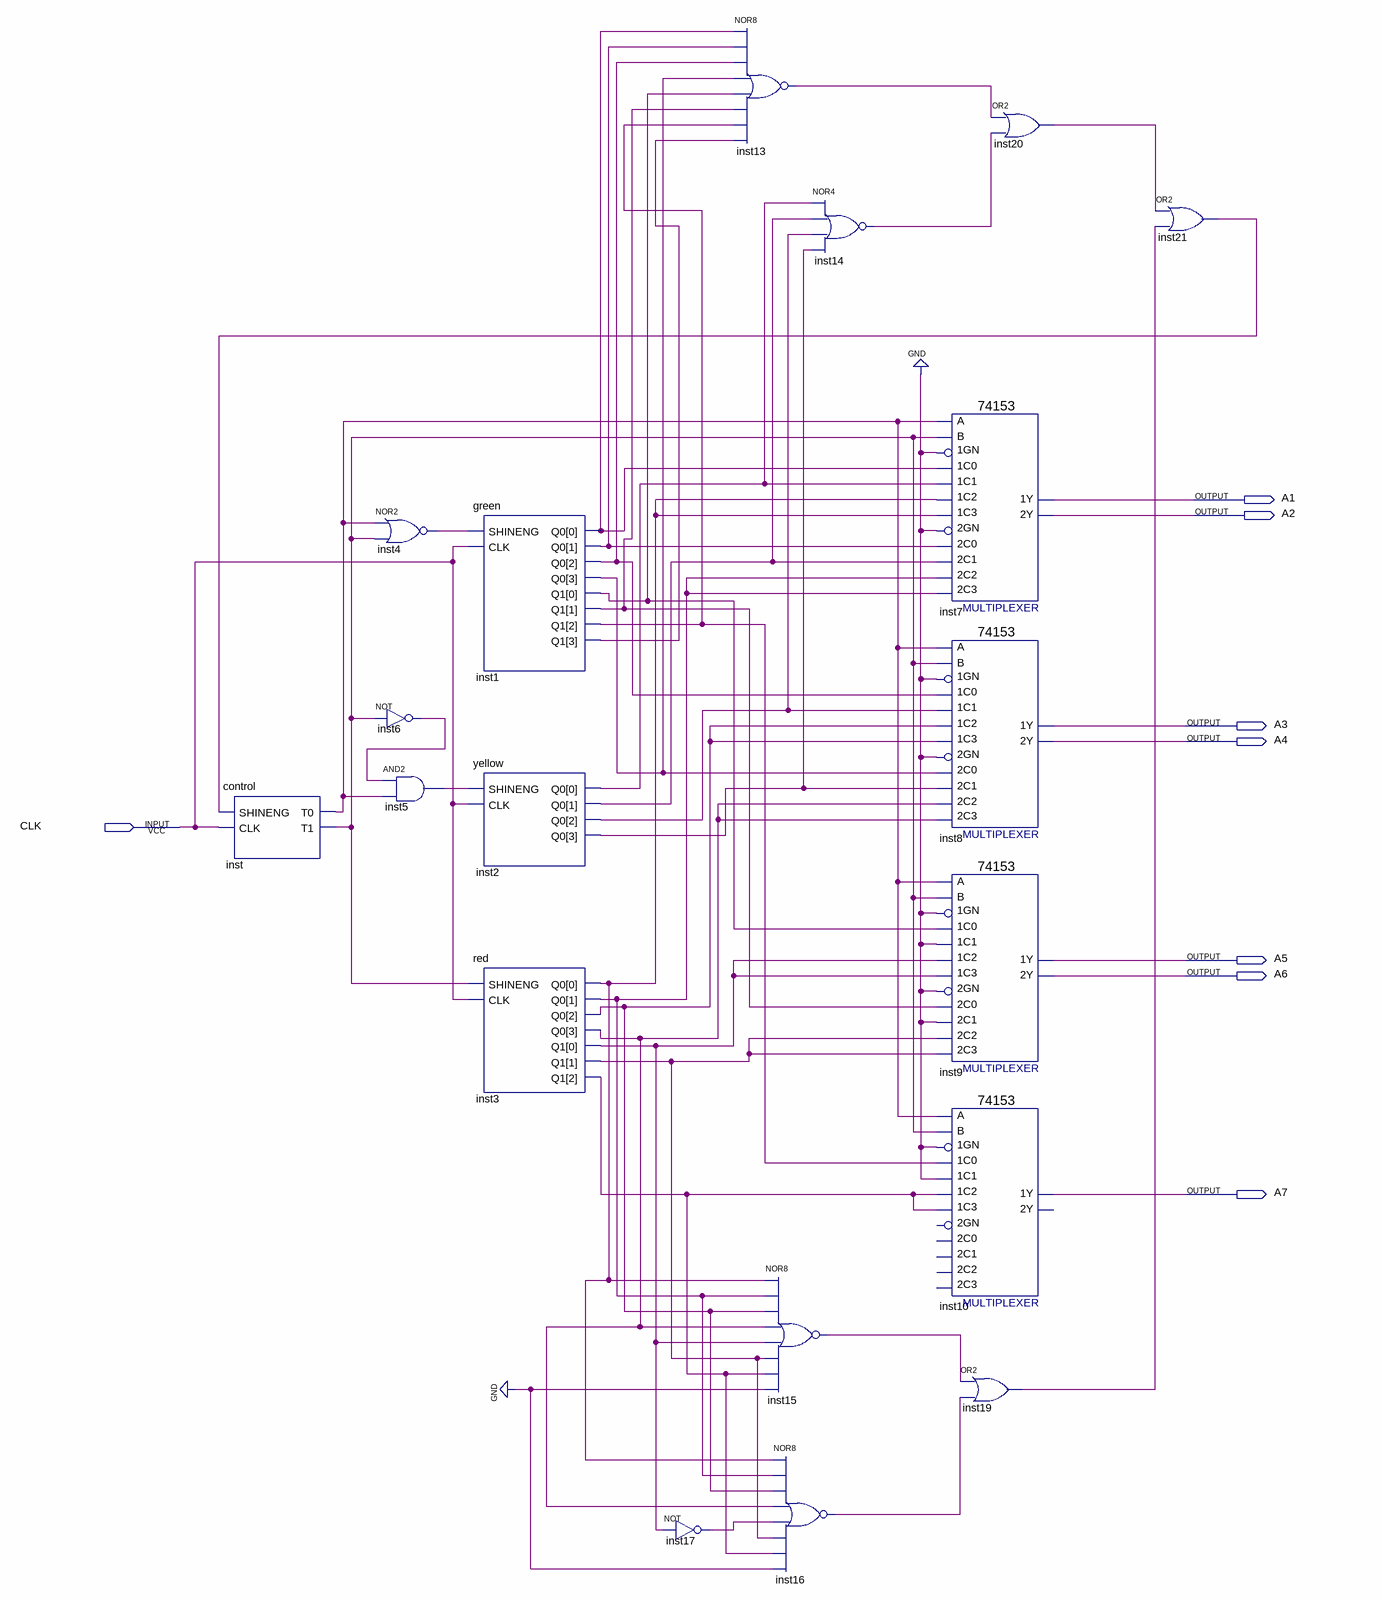
[diagram p0: schematic sheet]
// Quartus schematic southeast.bdf as structural Verilog: 19 symbols, 8 pins
module southeast (
  input  CLK,
  output A1,
  output A2,
  output A3,
  output A4,
  output A5,
  output A6,
  output A7
);

  wire inst1_q0, inst1_q0_2, inst1_q0_3, inst1_q0_4, inst1_q1, inst1_q1_2, inst1_q1_3, inst1_q1_4, inst2_q0,
       inst2_q0_2, inst2_q0_3, inst2_q0_4, inst3_q0, inst3_q0_2, inst3_q0_3, inst3_q0_4, inst3_q1,
       inst3_q1_2, inst3_q1_3, inst4_out, inst5_out, inst6_out, inst13_out, inst14_out, inst15_out,
       inst16_out, inst17_out, inst19_out, inst20_out, inst21_out, inst_t0, inst_t1;

  control inst (.SHINENG(inst21_out), .CLK(CLK), .T0(inst_t0), .T1(inst_t1));
  nor inst4 (inst4_out, inst_t0, inst_t1);
  not inst6 (inst6_out, inst_t1);
  and inst5 (inst5_out, inst6_out, inst_t0);
  green inst1 (
    .SHINENG(inst4_out), .CLK(CLK), .Q0({inst1_q0_4, inst1_q0_3, inst1_q0_2, inst1_q0}),
    .Q1({inst1_q1_3, inst1_q1_2, inst1_q1, inst1_q1_4}));
  yellow inst2 (.SHINENG(inst5_out), .CLK(CLK), .Q0({inst2_q0_4, inst2_q0_3, inst2_q0_2, inst2_q0}));
  red inst3 (
    .SHINENG(inst_t1), .CLK(CLK), .Q0({inst3_q0_4, inst3_q0_2, inst3_q0, inst3_q0_3}),
    .Q1({inst3_q1, inst3_q1_2, inst3_q1_3}));
  not inst17 (inst17_out, inst3_q1_3);
  nor inst13 (inst13_out, inst1_q0, inst1_q0_2, inst1_q0_3, inst1_q0_4, inst1_q1_4, inst1_q1, inst1_q1_2, inst1_q1_3);
  nor inst14 (inst14_out, inst2_q0, inst2_q0_2, inst2_q0_3, inst2_q0_4);
  nor inst15 (inst15_out, inst3_q0_3, inst3_q0, inst3_q0_2, inst3_q0_4, inst3_q1_3, inst3_q1_2, inst3_q1, 1'b0);
  nor inst16 (inst16_out, inst3_q0_3, inst3_q0, inst3_q0_2, inst3_q0_4, inst17_out, inst3_q1_2, inst3_q1, 1'b0);
  \74153  inst7 (
    .\1C1 (inst2_q0), .\1GN (1'b0), .\1C0 (inst1_q0), .\2C0 (inst1_q0_2), .\2GN (1'b0), .\2C2 (inst3_q0),
    .\1C2 (inst3_q0_3), .\1C3 (inst3_q0_3), .B(inst_t1), .A(inst_t0), .\2C1 (inst2_q0_2), .\2C3 (inst3_q0),
    .\1Y (A1), .\2Y (A2));
  \74153  inst8 (
    .\1C1 (inst2_q0_3), .\1GN (1'b0), .\1C0 (inst1_q0_3), .\2C0 (inst1_q0_4), .\2GN (1'b0),
    .\2C2 (inst3_q0_4), .\1C2 (inst3_q0_2), .\1C3 (inst3_q0_2), .B(inst_t1), .A(inst_t0), .\2C1 (inst2_q0_4),
    .\2C3 (inst3_q0_4), .\1Y (A3), .\2Y (A4));
  \74153  inst9 (
    .\1C1 (1'b0), .\1GN (1'b0), .\1C0 (inst1_q1_4), .\2C0 (inst1_q1), .\2GN (1'b0), .\2C2 (inst3_q1_2),
    .\1C2 (inst3_q1_3), .\1C3 (inst3_q1_3), .B(inst_t1), .A(inst_t0), .\2C1 (1'b0), .\2C3 (inst3_q1_2),
    .\1Y (A5), .\2Y (A6));
  \74153  inst10 (
    .\1C1 (1'b0), .\1GN (1'b0), .\1C0 (inst1_q1_2), .\1C2 (inst3_q1), .\1C3 (inst3_q1), .B(inst_t1),
    .A(inst_t0), .\1Y (A7));  // open: 2C0, 2GN, 2C2, 2C1, 2C3, 2Y
  or inst20 (inst20_out, inst13_out, inst14_out);
  or inst19 (inst19_out, inst15_out, inst16_out);
  or inst21 (inst21_out, inst20_out, inst19_out);
endmodule
